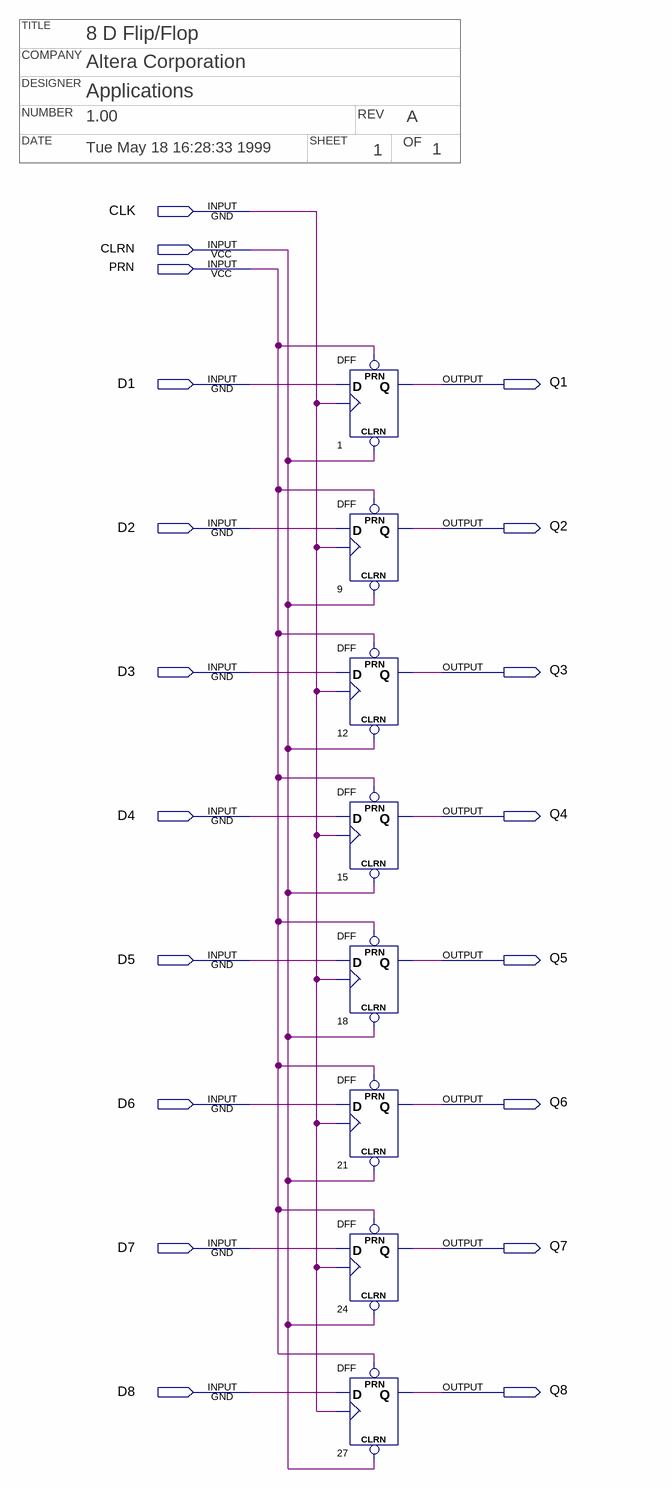
[diagram p0: schematic sheet]
// Quartus schematic 8dff.bdf as structural Verilog: 8 symbols, 19 pins
// Title block: TITLE: 8 D Flip/Flop; COMPANY: Altera Corporation; DESIGNER: Applications; NUMBER: 1.00; REV: A; DATE: Tue May 18 16:28:33 1999; SHEET: 1; OF: 1
module \8dff  (
  input  CLK,
  input  CLRN,
  input  PRN,
  input  D1,
  input  D2,
  input  D3,
  input  D4,
  input  D5,
  input  D6,
  input  D7,
  input  D8,
  output Q1,
  output Q2,
  output Q3,
  output Q4,
  output Q5,
  output Q6,
  output Q7,
  output Q8
);

  DFF u_1 (.CLRN(CLRN), .CLK(CLK), .D(D1), .PRN(PRN), .Q(Q1));
  DFF u_9 (.CLRN(CLRN), .CLK(CLK), .D(D2), .PRN(PRN), .Q(Q2));
  DFF u_12 (.CLRN(CLRN), .CLK(CLK), .D(D3), .PRN(PRN), .Q(Q3));
  DFF u_15 (.CLRN(CLRN), .CLK(CLK), .D(D4), .PRN(PRN), .Q(Q4));
  DFF u_18 (.CLRN(CLRN), .CLK(CLK), .D(D5), .PRN(PRN), .Q(Q5));
  DFF u_21 (.CLRN(CLRN), .CLK(CLK), .D(D6), .PRN(PRN), .Q(Q6));
  DFF u_24 (.CLRN(CLRN), .CLK(CLK), .D(D7), .PRN(PRN), .Q(Q7));
  DFF u_27 (.CLRN(CLRN), .CLK(CLK), .D(D8), .PRN(PRN), .Q(Q8));
endmodule
